# EAGLE schematic Optoisolator-v12 (EAGLE 7.7.0)
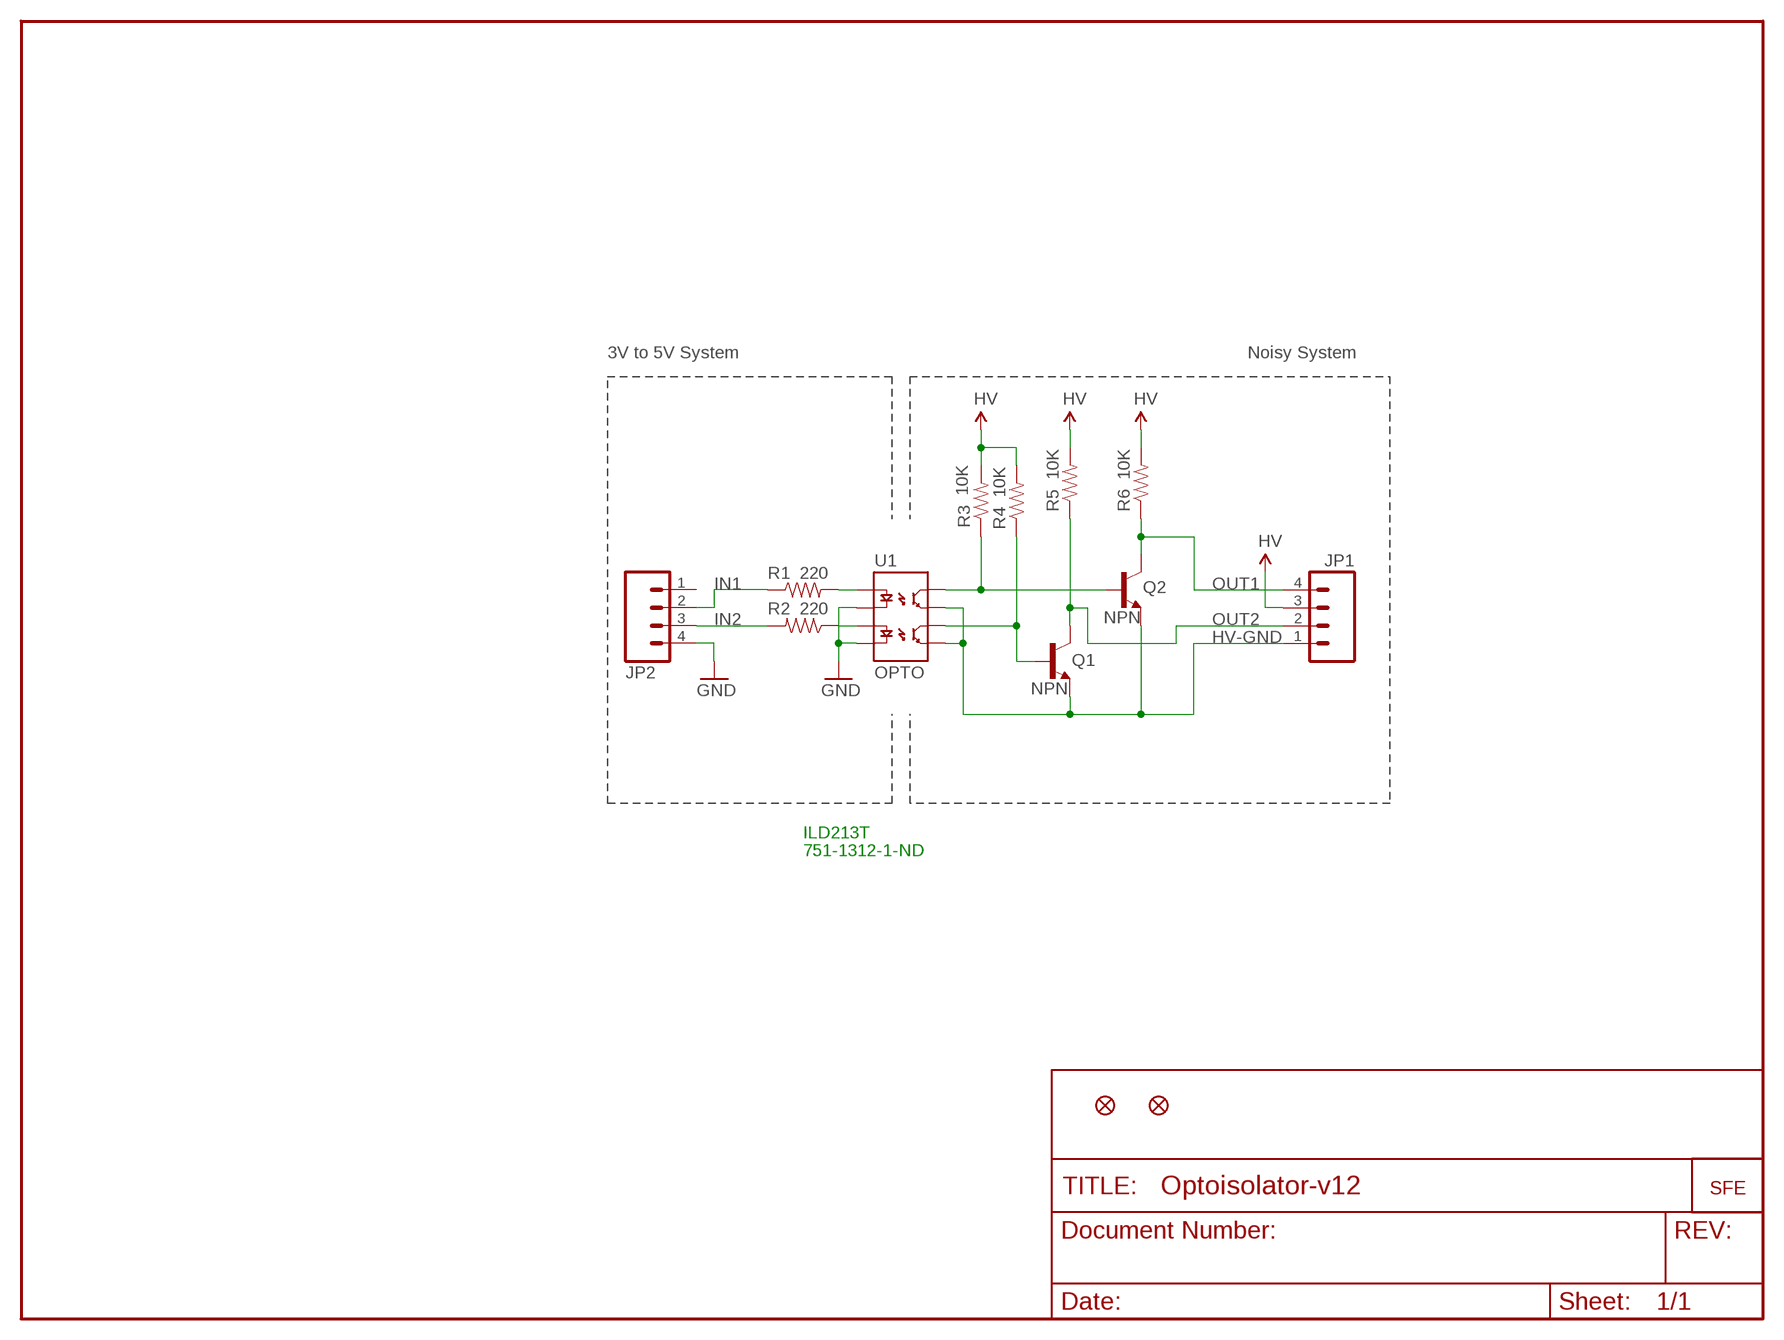
[diagram p0: schematic, sheet 1]

## Parts
JP1  M04PTH  [1X04]
JP2  M04PTH  [1X04]
Q1  NPN  TRANSISTOR_NPNSOT23-3  [SOT23-3]
Q2  NPN  TRANSISTOR_NPNSOT23-3  [SOT23-3]
R1  220  RESISTOR0402  [C0402]
R2  220  RESISTOR0402  [C0402]
R3  10K  RESISTOR0402  [C0402]
R4  10K  RESISTOR0402  [C0402]
R5  10K  RESISTOR0402  [C0402]
R6  10K  RESISTOR0402  [C0402]
U1  OPTO  OPTOISOLATOR-2SOIC8  [SO08-2]
U$1  LOGO-SFESK  [SFE-LOGO-FLAME]
U$2  FIDUCIAL1X2  [FIDUCIAL-1X2]
U$3  FIDUCIAL1X2  [FIDUCIAL-1X2]

## Nets
GND: JP2.4 U1.2(C1) U1.4(C2)
HV-GND: JP1.1 Q1.2(E) Q2.2(E) U1.5(EM2) U1.7(EM1)
IN1: JP2.2 R1.1
IN2: JP2.3 R2.2
N$1: R1.2 U1.1(A1)
N$2: R2.1 U1.3(A2)
OUT1: JP1.4 Q2.3(C) R6.1
OUT1N: Q2.1(B) R3.1 U1.8(CL1)
OUT2: JP1.2 Q1.3(C) R5.1
OUT2N: Q1.1(B) R4.1 U1.6(CL2)
VCC: JP1.3 R3.2 R4.2 R5.2 R6.2 ; supply symbol labelled HV
Unconnected: JP2.1

## Notes on the sheet
- 3V to 5V System | Noisy System
- ILD213T
- 751-1312-1-ND

## Library data of the parts
JP1 JP2 = SparkFun:M04: Header 4 Standard 4-pin 0.1" header. Use with straight break away headers (SKU : PRT-00116), right angle break away headers (PRT-00553), swiss pins (PRT-00743), machine pins (PRT-00117), and female headers (PRT-00115). Molex polarized connector foot print use with SKU : PRT-08231 with associated crimp pins and housings.
Q1 Q2 = SparkFun:TRANSISTOR_NPN: Transistor NPN BJT configuration in SOT23 package. MMBT2222 is the common NPN we use. Double check BCE configuration again layout.
R1-R6 = SparkFun:RESISTOR: Resistor Basic schematic elements and footprints for 0603, 1206, and PTH 1/10th watt (small) resistors.
U1 = SparkFun:OPTOISOLATOR-2: Description: Dual gate opto isolator. Vishay part : ILD213T
U$1 = SparkFun:LOGO-SFE: Spark Fun Electronics PCB Logo This is the standard Spark Fun Electronics PCB logo.
U$2 U$3 = SparkFun:FIDUCIAL: Fiducial Alignment Points Various fiducial points for machine vision alignment.